# EAGLE design untitled (EAGLE 9.6.2)
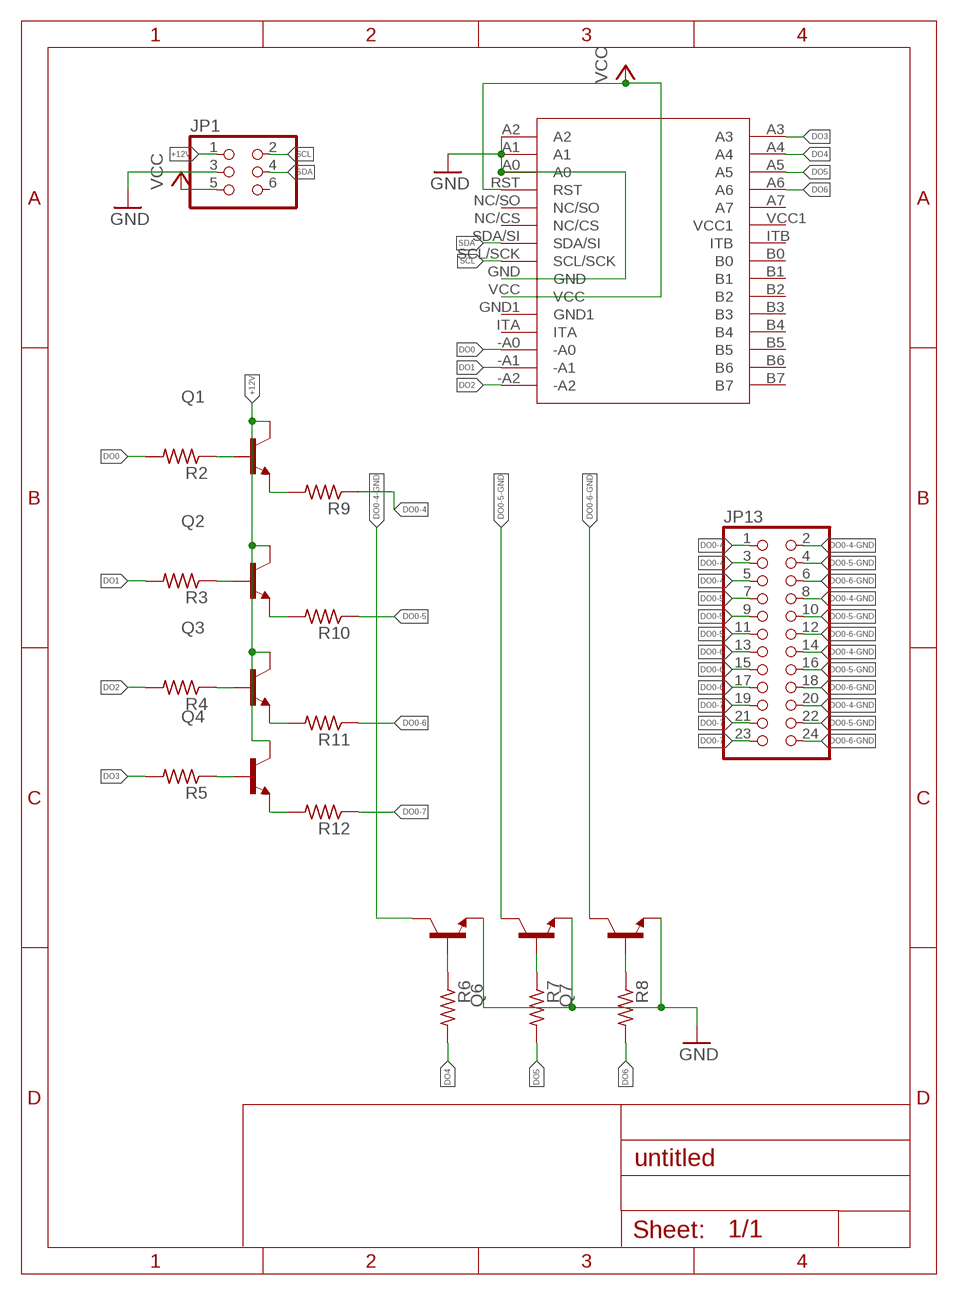
[diagram p0: schematic, sheet 1]

## Parts
JP1  PINHD-2X3  [2X03]
JP13  PINHD-2X12  [2X12]
MCP1  MCP23017  [MCP23017]
Q1  BCW31SMD  [SOT23-BEC]
Q2  BCW31SMD  [SOT23-BEC]
Q3  BCW31SMD  [SOT23-BEC]
Q4  BCW31SMD  [SOT23-BEC]
Q5  BCW31SMD  [SOT23-BEC]
Q6  BCW31SMD  [SOT23-BEC]
Q7  BCW31SMD  [SOT23-BEC]
R2  R-US_M0805  [M0805]
R3  R-US_M0805  [M0805]
R4  R-US_M0805  [M0805]
R5  R-US_M0805  [M0805]
R6  R-US_M0805  [M0805]
R7  R-US_M0805  [M0805]
R8  R-US_M0805  [M0805]
R9  R-US_M0805  [M0805]
R10  R-US_M0805  [M0805]
R11  R-US_M0805  [M0805]
R12  R-US_M0805  [M0805]

## Nets
+12V: JP1.1 Q1.C Q2.C Q3.C Q4.C
DO0: MCP1.-A0 R2.2
DO0-4: JP13.1 JP13.3 JP13.5 R9.1
DO0-4-GND: JP13.2 JP13.8 JP13.14 JP13.20 Q5.C
DO0-5: JP13.7 JP13.9 JP13.11 R10.1
DO0-5-GND: JP13.4 JP13.10 JP13.16 JP13.22 Q6.C
DO0-6: JP13.13 JP13.15 JP13.17 R11.1
DO0-6-GND: JP13.6 JP13.12 JP13.18 JP13.24 Q7.C
DO0-7: JP13.19 JP13.21 JP13.23 R12.1
DO1: MCP1.-A1 R3.2
DO2: MCP1.-A2 R4.2
DO3: MCP1.A3 R5.2
DO4: MCP1.A4 R6.2
DO5: MCP1.A5 R7.2
DO6: MCP1.A6 R8.2
GND: JP1.3 MCP1.A0 MCP1.A1 MCP1.A2 MCP1.GND Q5.E Q6.E Q7.E
N$2: Q1.B R2.1
N$3: Q2.B R3.1
N$4: Q3.B R4.1
N$5: Q4.B R5.1
N$7: Q5.B R6.1
N$8: Q6.B R7.1
N$9: Q7.B R8.1
N$10: Q1.E R9.2
N$11: Q2.E R10.2
N$12: Q3.E R11.2
N$13: Q4.E R12.2
SCL: JP1.2 MCP1.SCL/SCK
SDA: JP1.4 MCP1.SDA/SI
VCC: JP1.5 MCP1.RST MCP1.VCC
Unconnected: JP1.6 MCP1.A7 MCP1.B0 MCP1.B1 MCP1.B2 MCP1.B3 MCP1.B4 MCP1.B5 MCP1.B6 MCP1.B7 MCP1.GND1 MCP1.ITA MCP1.ITB MCP1.NC/CS MCP1.NC/SO MCP1.VCC1

## Library data of the parts
JP1 = pinhead:PINHD-2X3: PIN HEADER
JP13 = pinhead:PINHD-2X12: PIN HEADER
MCP1 = mcp23017:MCP23017
Q1-Q7 = BCW31_:BCW31*: NPN Transistor Check availability <https://pricing.snapeda.com/parts/BCW31/ON%20Semiconductor/view-part?ref=eda>; AVAILABILITY: In Stock; DESCRIPTION: Bipolar (BJT) Transistor NPN General Purpose Amplifier Surface Mount; MF: ON Semiconductor; MP: BCW31; PACKAGE: SOT-23 ON Semiconductor; PRICE: None; PURCHASE-URL: https://pricing.snapeda.com/search/part/BCW31/?ref=eda
R2-R12 = adafruit:R-US_: RESISTOR, American symbol

## Board
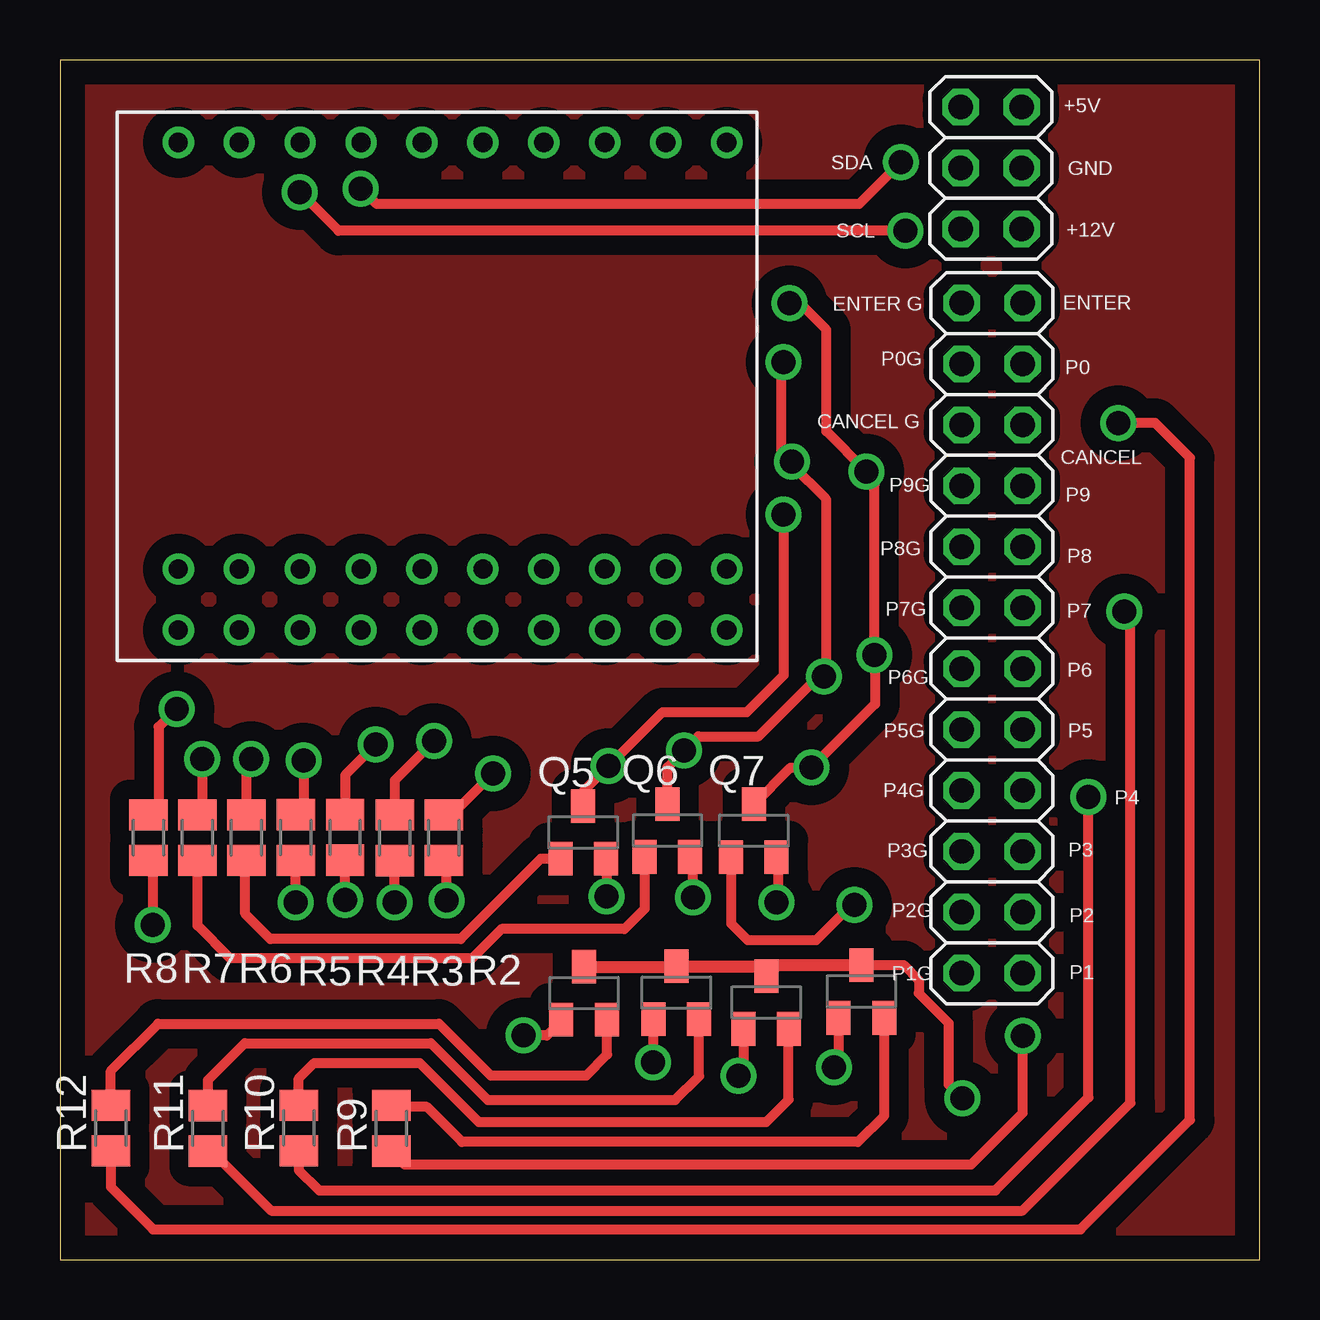
[diagram p1: board, top side]
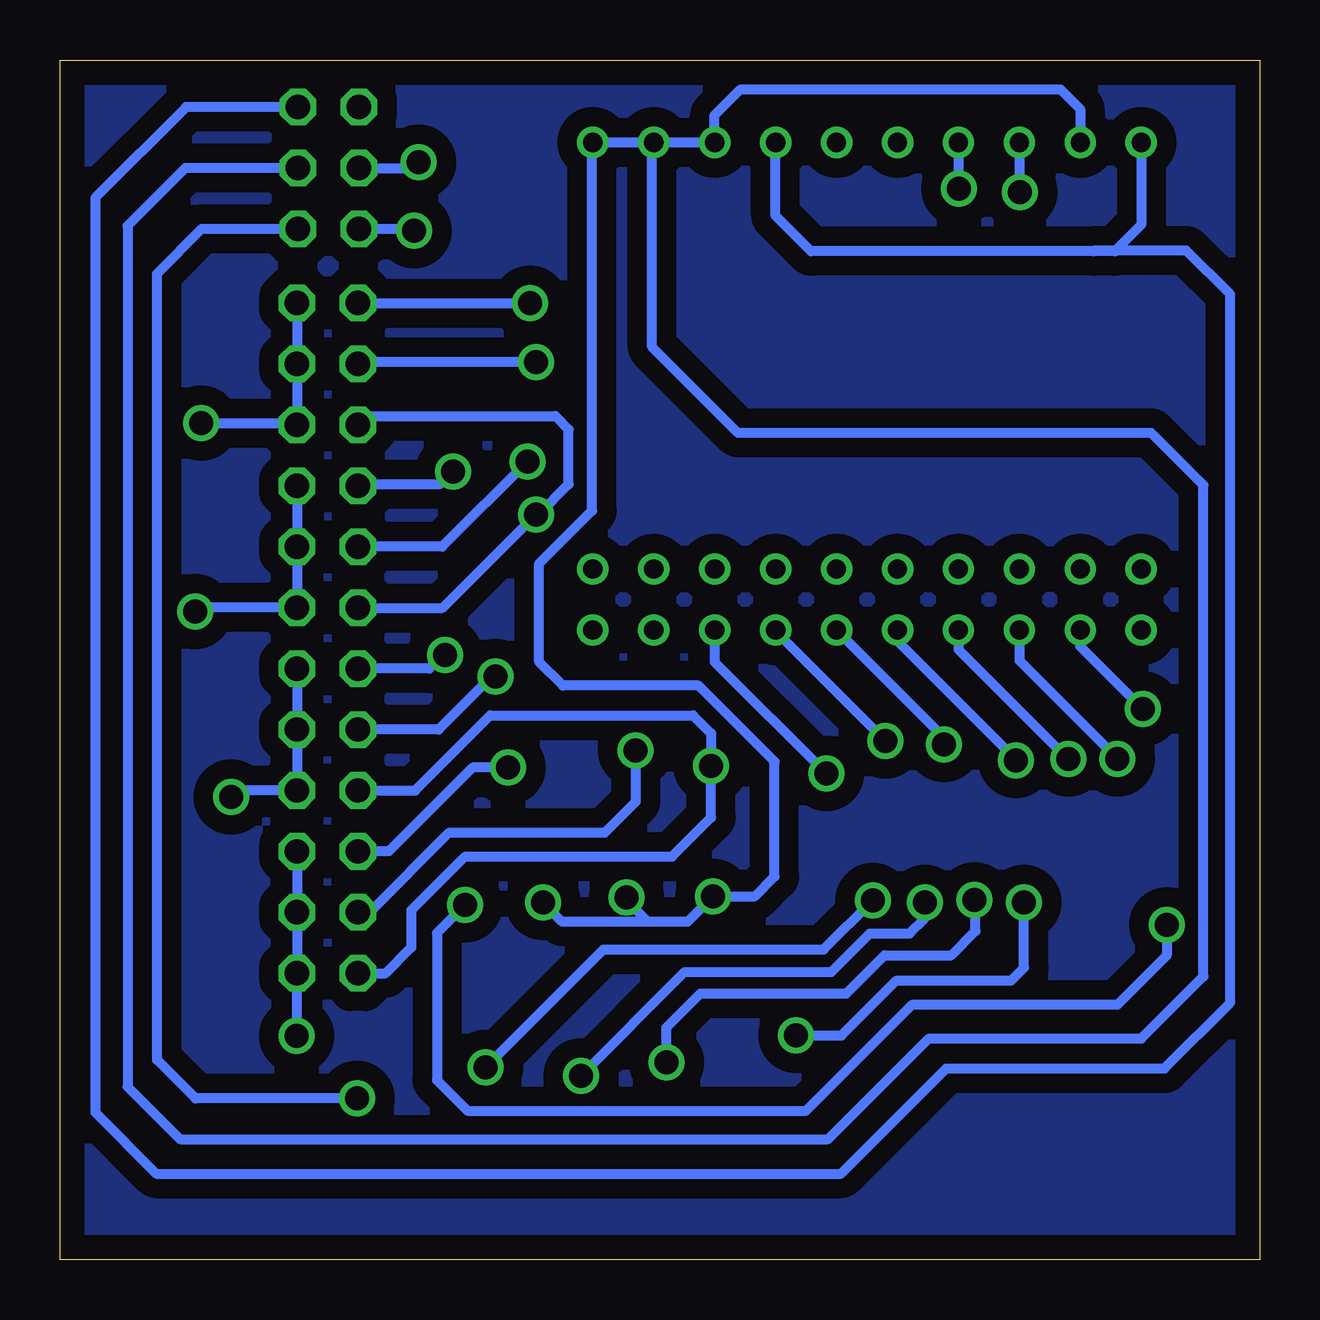
[diagram p2: board, bottom side, seen from below]

Size 50 x 50 mm. Coordinates in mm from the lower left corner, seen from the top.
Outline: 0,0 50,0 50,50 0,50 0,0
Copper layers (1*16): Top 0.035mm / dielectric 1.5mm / Bottom 0.035mm
Design rules "default": minimum track width 6mil, minimum drill 0.35mm, track to track 6mil, track to pad 6mil, pad to pad 6mil, via to via 6mil, smd to smd 6mil, copper to edge 40mil, drill to drill 6mil, minimum pad ring 10mil, minimum via ring 8mil, stop-mask expansion 4mil, vias tented up to drill 0mil, thermal gap 10mil

### Footprints (pad centres in the part's own frame; a part is rotated, then mirrored left to right if it is on the bottom)
2X03 = drill 1.016 octagon: 1 -2.54,-1.27; 2 -2.54,1.27; 3 0,-1.27; 4 0,1.27; 5 2.54,-1.27; 6 2.54,1.27
2X12 = drill 1.016 octagon: 1 -13.97,-1.27; 2 -13.97,1.27; 3 -11.43,-1.27; 4 -11.43,1.27; 5 -8.89,-1.27; 6 -8.89,1.27; 7 -6.35,-1.27; 8 -6.35,1.27; 9 -3.81,-1.27; 10 -3.81,1.27; 11 -1.27,-1.27; 12 -1.27,1.27; 13 1.27,-1.27; 14 1.27,1.27; 15 3.81,-1.27; 16 3.81,1.27; 17 6.35,-1.27; 18 6.35,1.27; 19 8.89,-1.27; 20 8.89,1.27; 21 11.43,-1.27; 22 11.43,1.27; 23 13.97,-1.27; 24 13.97,1.27
MCP23017 = drill 0.8: -A0 11.43,6.35; -A1 11.43,3.81; -A2 11.43,1.27; A0 -8.89,6.35; A1 -8.89,8.89; A2 -8.89,11.43; A3 11.43,-1.27; A4 11.43,-3.81; A5 11.43,-6.35; A6 11.43,-8.89; A7 11.43,-11.43; B0 8.89,6.35; B1 8.89,3.81; B2 8.89,1.27; B3 8.89,-1.27; B4 8.89,-3.81; B5 8.89,-6.35; B6 8.89,-8.89; B7 8.89,-11.43; GND -8.89,-8.89; GND1 11.43,11.43; ITA 11.43,8.89; ITB 8.89,8.89; NC/CS -8.89,-1.27; NC/SO -8.89,1.27; RST -8.89,3.81; SCL/SCK -8.89,-6.35; SDA/SI -8.89,-3.81; VCC -8.89,-11.43; VCC1 8.89,11.43
SOT23-BEC = smd 1 x 1.4: B -0.95,-1.1; C 0,1.1; E 0.95,-1.1
M0805 = smd 1.3 x 1.6: 1 -0.95,0; 2 0.95,0

### Placement (x,y rotation side)
JP1  38.81,45.5 90 top
JP13  38.85,25.9 90 top
MCP1  16.36,37.67 270 top
Q1  33.41,11.17 0 top
Q2  29.44,10.72 0 top
Q3  25.69,11.13 0 top
Q4  21.84,11.11 0 top
Q5  21.81,17.8 0 top
Q6  25.32,17.88 0 top
Q7  28.92,17.87 0 top
R2  16.01,17.58 90 top
R3  13.95,17.58 90 top
R4  11.89,17.59 90 top
R5  9.83,17.59 90 top
R6  7.77,17.59 90 top
R7  5.73,17.58 90 top
R8  3.69,17.58 90 top
R9  13.8,5.47 90 top
R10  9.95,5.48 90 top
R11  6.17,5.47 90 top
R12  2.12,5.48 90 top

### Tracks (layer width: path | path; a pad name or v marks a point on that pad's centre or on a via)
+12V  (via drill 1)
  Top 0.406: Q1.C 35.17,12.27 35.8,11.64 35.8,11.1 37.04,9.86 37.04,7.3 v37.62,6.71
  Top 0.508: Q4.C 25.66,12.21 Q3.C | Q3.C 29.03,12.23 Q2.C 29.9,12.27 Q1.C
  Top 0.61: Q3.C | Q4.C | Q2.C
  Bottom 0.406: v37.62,6.71 44.35,6.71 45.95,8.31 45.95,41.09 44.08,42.96 JP1.1
DO0  (via drill 1)
  Top 0.406: v18.05,20.25 16.33,18.53 R2.2
  Bottom 0.406: MCP1.-A0 22.71,24.91 v18.05,20.25 | v18.05,20.25
DO0-4  (via drill 1)
  Top 0.406: R9.1 14.37,3.95 37.98,3.95 40.13,6.11 v40.13,9.32
  Bottom 0.406: v40.13,9.32 40.13,11.92 JP13.1 JP13.3 JP13.5
DO0-4-GND  (via drill 1)
  Top 0.406: Q5.C 21.81,19.5 v22.87,20.57 25.12,22.82 28.63,22.82 30.17,24.36 30.17,31.05 v30.16,31.06
  Bottom 0.406: JP13.14 37.56,27.16 34.06,27.16 v30.16,31.06 | v30.16,31.06 | 30.1,31.11 v30.16,31.06 | JP13.2 36.43,11.93 35.36,13.01 35.36,14.56 33.11,16.8 24.48,16.8 22.86,18.42 v22.86,20.58 | v22.86,20.58 v22.87,20.57 | JP13.8 35.2,19.55 32.07,22.68 23.61,22.68 22.86,21.93 v22.86,20.58 | v30.16,31.06 30.05,31.06 28.79,32.32 28.79,34.6 29.35,35.16 37.21,35.16 JP13.20
DO0-5  (via drill 1)
  Top 0.406: R10.1 9.95,3.73 10.8,2.88 38.99,2.88 42.87,6.75 v42.87,19.27
  Bottom 0.406: v42.87,19.27 42.59,19.55 JP13.7 JP13.9 JP13.11
DO0-5-GND  (via drill 1)
  Top 0.406: Q6.C 25.32,20.51 v26.02,21.21 26.61,21.81 29.12,21.81 31.62,24.3 v31.85,24.3 31.92,24.38 31.92,31.71 30.51,33.12 v30.51,33.27 30.08,33.7 30.08,37.31 v30.16,37.4
  Bottom 0.406: JP13.10 34.22,22.09 32.01,24.3 v31.85,24.3 | JP13.4 37.1,14.47 33.77,17.8 27.29,17.8 26,19.09 26,21.24 v26.02,21.21 | v30.51,33.27 34.07,29.71 JP13.16 | v30.16,37.4 37.51,37.4 JP13.22
DO0-6  (via drill 1)
  Top 0.406: R11.1 6.33,4.52 8.81,2.03 40.12,2.03 44.62,6.53 44.62,26.76 v44.38,27.01
  Bottom 0.406: v44.38,27.01 44.21,27.17 JP13.13 JP13.15 JP13.17
DO0-6-GND  (via drill 1)
  Top 0.406: Q7.C 30.45,20.5 v31.33,20.5 33.98,23.15 33.98,25.17 v33.95,25.2 33.95,32.3 33.62,32.63 v33.62,32.85 31.94,34.53 31.94,38.76 30.84,39.86 v30.41,39.86
  Bottom 0.406: v31.33,20.5 32.8,20.5 36.3,17.01 JP13.6 | v33.95,25.2 34.05,25.2 34.61,24.63 JP13.12 | v33.62,32.85 34.14,32.33 36.98,32.33 37.06,32.25 JP13.18 | JP13.24 37.56,39.86 v30.41,39.86
DO0-7  (via drill 1)
  Top 0.406: R12.1 2.12,3.03 3.88,1.26 42.54,1.26 47.1,5.82 47.1,33.42 45.65,34.87 v44.12,34.87
  Bottom 0.406: v44.12,34.87 40.2,34.87 JP13.19 JP13.21 JP13.23
DO1  (via drill 1)
  Top 0.406: v15.59,21.61 13.95,19.97 R3.2
  Bottom 0.406: MCP1.-A1 20.17,26.19 v15.59,21.61 | v15.59,21.61
DO2  (via drill 1)
  Top 0.406: v13.15,21.46 11.89,20.19 R4.2
  Bottom 0.406: MCP1.-A2 13.05,21.66 13.05,21.52 13.11,21.46 v13.15,21.46
DO3  (via drill 1)
  Top 0.406: v10.15,20.81 10.15,18.86 R5.2
  Bottom 0.406: MCP1.A3 15.09,25.78 10.13,20.83 v10.15,20.81 | v10.15,20.81
DO4  (via drill 1)
  Top 0.406: v7.97,20.86 7.77,20.66 R6.2
  Bottom 0.406: MCP1.A4 12.55,25.42 7.98,20.85 v7.97,20.86 | v7.97,20.86
DO5  (via drill 1)
  Top 0.406: v5.93,20.86 5.93,18.73 R7.2
  Bottom 0.406: MCP1.A5 10.01,24.96 5.93,20.88 v5.93,20.86
DO6  (via drill 1)
  Top 0.406: v4.86,22.95 4.11,22.2 4.11,18.96 R8.2
  Bottom 0.406: MCP1.A6 7.47,25.56 v4.86,22.95
GND  (via drill 1)
  Top 0.406: Q5.E 22.77,16.68 v22.77,15.14 v22.78,15.14 | v26.39,15.09 26.39,16.66 Q6.E | Q7.E 29.93,16.71 29.93,14.94 v29.87,14.89
  Bottom 0.406: 25.48,14.08 23.84,14.08 v22.78,15.14 21.04,15.14 20.22,15.96 20.22,20.76 23.38,23.92 29.04,23.92 30.03,24.91 30.03,29.01 27.82,31.21 27.82,46.51 | 25.48,14.08 26.39,14.99 v26.39,15.09 | 25.48,14.08 29.07,14.08 v29.87,14.89 | 27.82,46.51 27.82,46.53 MCP1.A2 | MCP1.A1 27.77,46.56 27.82,46.51 | MCP1.A1 MCP1.A0 22.71,47.71 21.64,48.78 8.3,48.78 7.47,47.95 MCP1.GND | JP1.3 44.77,45.5 47.19,43.09 47.19,7.2 44.99,5.01 17.98,5.01 13.78,9.22 4.92,9.22 2.34,11.8 2.34,32.27 4.52,34.45 21.74,34.45 25.32,38.03 25.32,46.49 MCP1.A1
N$1
  pour Bottom (isolate 0.813): 0,50 50,50 50,0 0,0
N$2  (via drill 1)
  Top 0.406: v32.26,8 32.46,8.19 Q1.B | v16.12,14.97 16.12,16.52 R2.1
  Bottom 0.406: v32.26,8 29.25,11.01 27.34,12.92 18.17,12.92 v16.12,14.97
N$3  (via drill 1)
  Top 0.406: Q2.B 28.49,7.86 v28.29,7.66 | v13.96,14.89 v13.95,14.89 R3.1
  Bottom 0.406: v13.96,14.89 13.96,14.22 14.59,13.59 16.25,13.59 17.85,11.99 23.96,11.99 v28.29,7.66
N$4  (via drill 1)
  Top 0.406: Q3.B 24.73,10.01 v24.73,8.22 | v11.88,14.98 11.88,16.63 R4.1
  Bottom 0.406: v11.88,14.98 11.84,14.95 11.84,13.7 12.85,12.68 15.63,12.68 17.23,11.09 23.31,11.09 24.73,9.67 v24.73,8.22
N$5  (via drill 1)
  Top 0.406: Q4.B 20.89,9.94 20.29,9.34 v19.32,9.34 | v9.82,14.88 9.83,14.9 R5.1
  Bottom 0.406: v19.32,9.34 17.43,9.34 15.13,11.63 10.35,11.63 9.82,12.16 v9.82,14.88
N$6
  pour Top (isolate 0.813): 0,50 50,50 50,0 0,0
N$7
  Top 0.406: R6.1 7.73,16.59 7.73,14.41 8.77,13.36 16.7,13.36 20.04,16.7 Q5.B
N$8
  Top 0.406: Q6.B 24.37,14.62 23.52,13.78 18.41,13.78 17.18,12.55 7.1,12.55 5.74,13.92 R7.1
N$9  (via drill 1)
  Top 0.406: Q7.B 27.97,14.01 28.66,13.31 31.53,13.31 33,14.78 v33.11,14.78 | R8.1 3.87,16.45 v3.87,13.95
  Bottom 0.406: v33.11,14.78 34.29,13.61 34.29,7.47 33.02,6.2 18.9,6.2 14.46,10.63 5.92,10.63 4.46,12.09 3.87,12.67 v3.87,13.95
N$10
  Top 0.406: Q1.E 34.36,6 33.26,4.9 16.76,4.9 15.3,6.36 13.87,6.36 R9.2
N$11
  Top 0.406: Q2.E 30.37,9.59 30.37,6.66 29.44,5.74 17.45,5.74 14.99,8.2 10.6,8.2 9.95,7.55 R10.2
N$12
  Top 0.406: Q3.E 26.64,7.64 25.65,6.65 17.83,6.65 15.46,9.02 7.7,9.02 6.17,7.49 R11.2
N$13
  Top 0.406: Q4.E 22.81,9.99 22.81,8.54 21.94,7.67 17.95,7.67 15.8,9.83 4.09,9.83 2.12,7.86 R12.2
SCL  (via drill 1)
  Top 0.406: v35.24,42.88 11.61,42.88 10,44.48 v9.99,44.48
  Bottom 0.406: JP1.2 35.32,42.96 v35.24,42.88 | v9.99,44.48 9.99,46.54 MCP1.SCL/SCK
SDA  (via drill 1)
  Top 0.406: v35.05,45.74 33.3,43.99 13.2,43.99 12.55,44.64 12.54,44.64 v12.53,44.63
  Bottom 0.406: JP1.4 35.29,45.5 v35.05,45.74 | v12.53,44.63 12.53,46.54 MCP1.SDA/SI
VCC
  Bottom 0.406: MCP1.VCC 4.93,43.13 6.03,42.03 6.91,42.03 | 6.91,42.03 18.7,42.03 20.17,43.5 MCP1.RST | JP1.5 44.74,48.04 48.53,44.25 48.53,6.13 45.98,3.58 17.45,3.58 13.06,7.96 3.96,7.96 1.22,10.7 1.22,40.23 3.05,42.06 6.88,42.06 6.91,42.03

### Text on the board
tPlace: +5V | SDA | GND | SCL | +12V | ENTER G | ENTER | P0G | P0 | CANCEL G | CANCEL | P9G | P9 | P8G | P8 | P7G | P7 | P6G | P6 | P5G | P5 | P4G | P4 | P3G | P3 | P2G | P2 | P1G | P1